# EAGLE design UART_Iso (EAGLE 9.6.2)
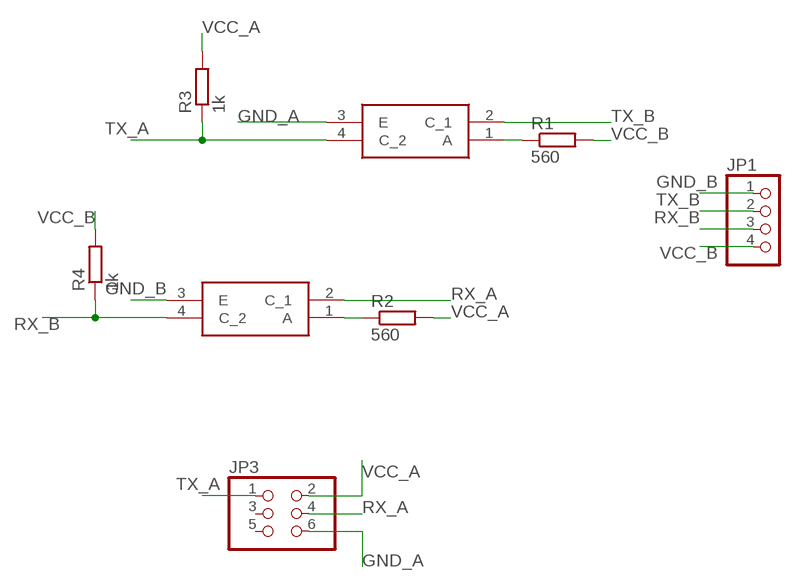
[diagram p0: schematic, sheet 1]

## Parts
JP1  PINHD-1X4/90  [1X04/90]
JP3  PINHD-2X3  [2X03]
Q1  SFH6186-5T  [SOP254P978X406-4N]
Q2  SFH6186-5T  [SOP254P978X406-4N]
R1  560  R-EU_R0805  [R0805]
R2  560  R-EU_R0805  [R0805]
R3  1k  R-EU_R0805  [R0805]
R4  1k  R-EU_R0805  [R0805]

## Nets
GND_A: JP3.6 Q2.3(E)
GND_B: JP1.1 Q1.3(E)
N$1: Q2.1(A) R1.1
N$5: Q1.1(A) R2.1
RX_A: JP3.4 Q1.2(C_1)
RX_B: JP1.3 Q1.4(C_2) R4.1
TX_A: JP3.1 Q2.4(C_2) R3.1
TX_B: JP1.2 Q2.2(C_1)
VCC_A: JP3.2 R2.2 R3.2
VCC_B: JP1.4 R1.2 R4.2
Unconnected: JP3.3 JP3.5

## Library data of the parts
JP1 = pinhead:PINHD-1X4: PIN HEADER
JP3 = pinhead:PINHD-2X3: PIN HEADER
Q1 Q2 = SFH6186-5T:SFH6186-5T: Optocoupler Transistor O/P 1-CH Source: Datasheet <https://componentsearchengine.com/Datasheets/2/SFH6186-5T.pdf>; ARROW_PART_NUMBER: SFH6186-5T; ARROW_PRICE-STOCK: https://www.arrow.com/en/products/sfh6186-5t/vishay; DESCRIPTION: Optocoupler Transistor O/P 1-CH; HEIGHT: 4.059mm; MANUFACTURER_NAME: Vishay; MANUFACTURER_PART_NUMBER: SFH6186-5T; MOUSER_PART_NUMBER: 782-SFH6186-5T; MOUSER_PRICE-STOCK: https://www.mouser.co.uk/ProductDetail/Vishay-Semiconductors/SFH6186-5T?qs=xCMk%252BIHWTZP2pDh9KWgmcg%3D%3D
R1-R4 = rcl:R-EU_: RESISTOR, European symbol; SPICEPREFIX: R

## Board
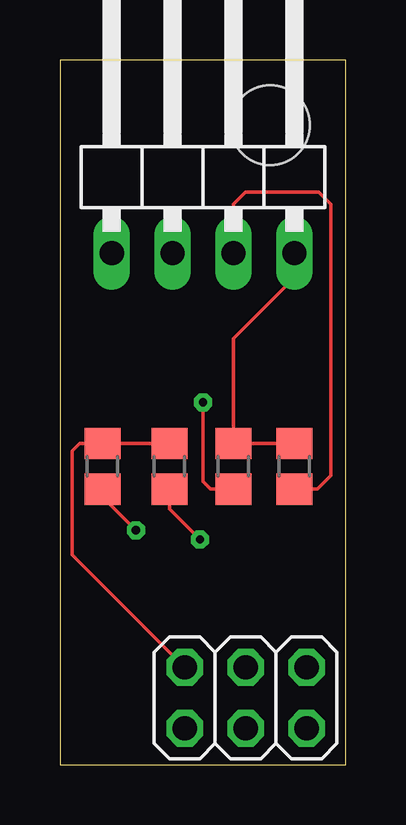
[diagram p1: board, top side]
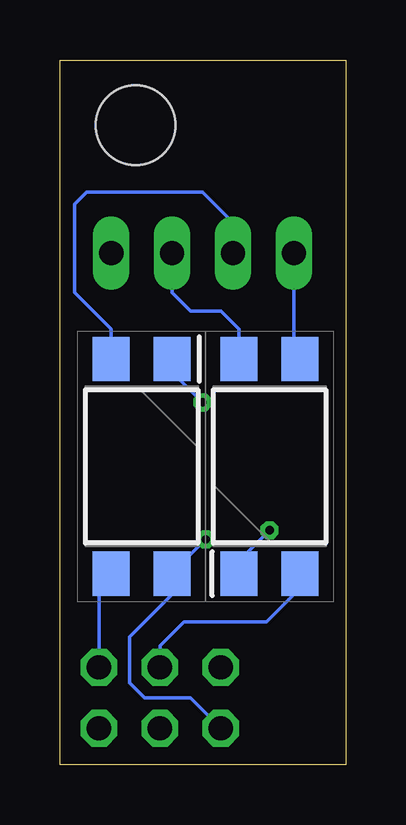
[diagram p2: board, bottom side, seen from below]

Size 11.92 x 29.39 mm. Coordinates in mm from the lower left corner, seen from the top.
Outline: 0,0 11.92,0 11.92,29.39 0,29.39 0,0
Copper layers (1*16): Top 0.035mm / dielectric 1.5mm / Bottom 0.035mm
Design rules "jlcpcb": minimum track width 3.5mil, minimum drill 0.2mm, track to track 3.5mil, track to pad 5mil, pad to pad 5mil, via to via 5mil, smd to smd 5mil, copper to edge 0.2mm, drill to drill 8mil, minimum pad ring 10mil, minimum via ring 8mil, stop-mask expansion 4mil, vias tented up to drill 0mil, thermal gap 10mil
Holes 3.3 mm at 8.76,26.67

### Footprints (pad centres in the part's own frame; a part is rotated, then mirrored left to right if it is on the bottom)
1X04/90 = drill 1.016 long: 1 -3.81,-3.81; 2 -1.27,-3.81; 3 1.27,-3.81; 4 3.81,-3.81
2X03 = drill 1.016 octagon: 1 -2.54,-1.27; 2 -2.54,1.27; 3 0,-1.27; 4 0,1.27; 5 2.54,-1.27; 6 2.54,1.27
SOP254P978X406-4N = smd 1.85 x 1.55: 1 -4.475,1.27; 2 -4.475,-1.27; 3 4.475,-1.27; 4 4.475,1.27
R0805 = smd 1.3 x 1.5: 1 -0.95,0; 2 0.95,0

### Placement (x,y rotation side)
JP1  5.97,25.15 0 top
JP3  7.75,2.79 0 top
Q1  3.17,12.45 90 bottom
Q2  8.51,12.45 270 bottom
R1  7.24,12.45 90 top
R2  1.78,12.45 90 top
R3  4.57,12.45 90 top
R4  9.78,12.45 90 top

### Tracks (layer width: path | path; a pad name or v marks a point on that pad's centre or on a via)
GND_A
  Bottom 0.152: Q2.3 10.29,7.46 JP3.6
GND_B
  Bottom 0.152: JP1.1 2.16,17.18 Q1.3
N$1  (via drill 0.35)
  Top 0.152: R1.1 6.28,11.5 5.97,11.81 v5.97,15.11
  Bottom 0.152: v5.97,15.11 7.24,16.38 Q2.1
N$5  (via drill 0.35)
  Top 0.152: R2.1 1.78,11.18 v3.17,9.78
  Bottom 0.152: v3.17,9.78 4.45,8.51 Q1.1
RX_A
  Bottom 0.152: Q1.2 1.91,7.37 3.3,5.97 6.73,5.97 7.75,4.95 JP3.4
RX_B
  Top 0.152: R4.1 10.73,11.5 11.3,12.07 11.3,23.37 10.8,23.88 7.75,23.88 7.24,23.37 JP1.3
  Bottom 0.152: Q1.4 4.45,18.16 5.21,18.92 6.48,18.92 7.24,19.68 JP1.3
TX_A  (via drill 0.35)
  Top 0.152: R3.1 4.57,10.67 v5.84,9.4
  Bottom 0.152: v5.84,9.4 7.24,8 Q2.4 7.24,7.11 9.02,5.33 9.02,3.43 8.38,2.79 6.48,2.79 JP3.1
TX_B
  Bottom 0.152: JP1.2 4.7,22.61 5.97,23.88 10.8,23.88 11.3,23.37 11.3,19.68 9.78,18.16 Q2.2
VCC_A
  Top 0.152: R3.2 R2.2 0.82,13.4 0.51,13.08 0.51,8.76 JP3.2
VCC_B
  Top 0.152: JP1.4 9.78,20.32 7.24,17.78 R1.2 R4.2

### Text on the board
tValues: (c) LBre / 04-21
bValues: .1 | 1.